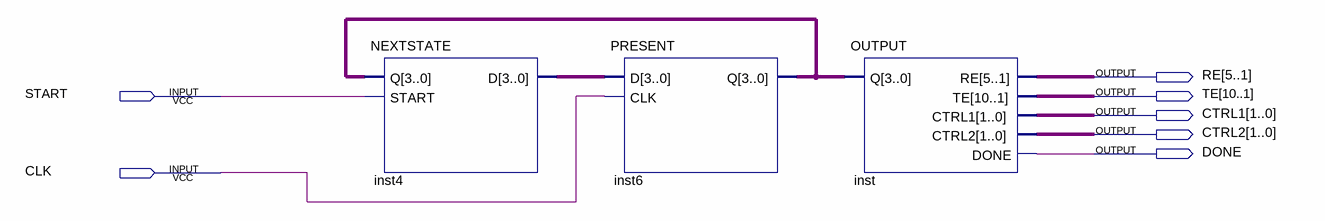
[diagram p0: schematic sheet]
// Quartus schematic CONTROLLER.bdf as structural Verilog: 3 symbols, 7 pins
module CONTROLLER (
  input  START,
  input  CLK,
  output [5:1] RE,
  output [10:1] TE,
  output [1:0] CTRL1,
  output [1:0] CTRL2,
  output DONE
);

  wire [3:0] inst4_d, inst6_q;

  NEXTSTATE inst4 (.Q(inst6_q), .START(START), .D(inst4_d));
  PRESENT inst6 (.D(inst4_d), .CLK(CLK), .Q(inst6_q));
  OUTPUT inst (.Q(inst6_q), .RE(RE), .TE(TE), .CTRL1(CTRL1), .CTRL2(CTRL2), .DONE(DONE));
endmodule
